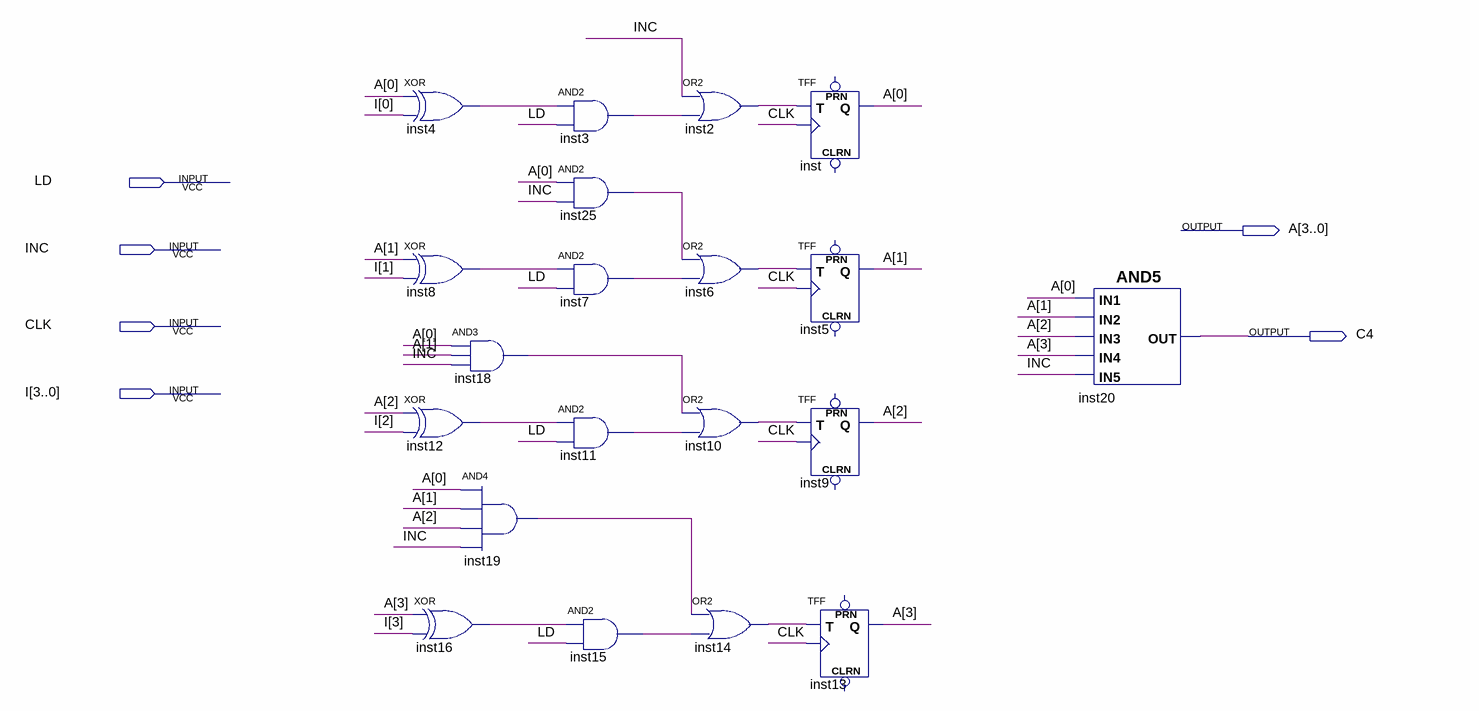
[diagram p0: schematic sheet]
// Quartus schematic REG4_LD_INC.bdf as structural Verilog: 20 symbols, 6 pins
module REG4_LD_INC (
  input  LD,
  input  INC,
  input  CLK,
  input  [3:0] I,
  output [3:0] A,
  output C4
);

  wire inst2_out, inst3_out, inst4_out, inst6_out, inst7_out, inst8_out, inst10_out, inst11_out, inst12_out,
       inst14_out, inst15_out, inst16_out, inst18_out, inst19_out, inst25_out;

  xor inst4 (inst4_out, A[0], I[0]);
  xor inst8 (inst8_out, A[1], I[1]);
  and inst18 (inst18_out, A[0], A[1], INC);
  xor inst12 (inst12_out, A[2], I[2]);
  and inst19 (inst19_out, A[0], A[1], A[2], INC);
  xor inst16 (inst16_out, A[3], I[3]);
  and inst3 (inst3_out, inst4_out, LD);
  and inst25 (inst25_out, A[0], INC);
  and inst7 (inst7_out, inst8_out, LD);
  and inst11 (inst11_out, inst12_out, LD);
  and inst15 (inst15_out, inst16_out, LD);
  or inst2 (inst2_out, INC, inst3_out);
  or inst6 (inst6_out, inst25_out, inst7_out);
  or inst10 (inst10_out, inst18_out, inst11_out);
  or inst14 (inst14_out, inst19_out, inst15_out);
  TFF inst (.T(inst2_out), .CLK(CLK), .Q(A[0]));  // open: PRN, CLRN
  TFF inst5 (.T(inst6_out), .CLK(CLK), .Q(A[1]));  // open: PRN, CLRN
  TFF inst9 (.T(inst10_out), .CLK(CLK), .Q(A[2]));  // open: PRN, CLRN
  TFF inst13 (.T(inst14_out), .CLK(CLK), .Q(A[3]));  // open: PRN, CLRN
  and inst20 (C4, A[0], A[1], A[2], A[3], INC);
endmodule
